# EAGLE design Suberu4 (EAGLE 5.11)

## Sheet 1 of 3
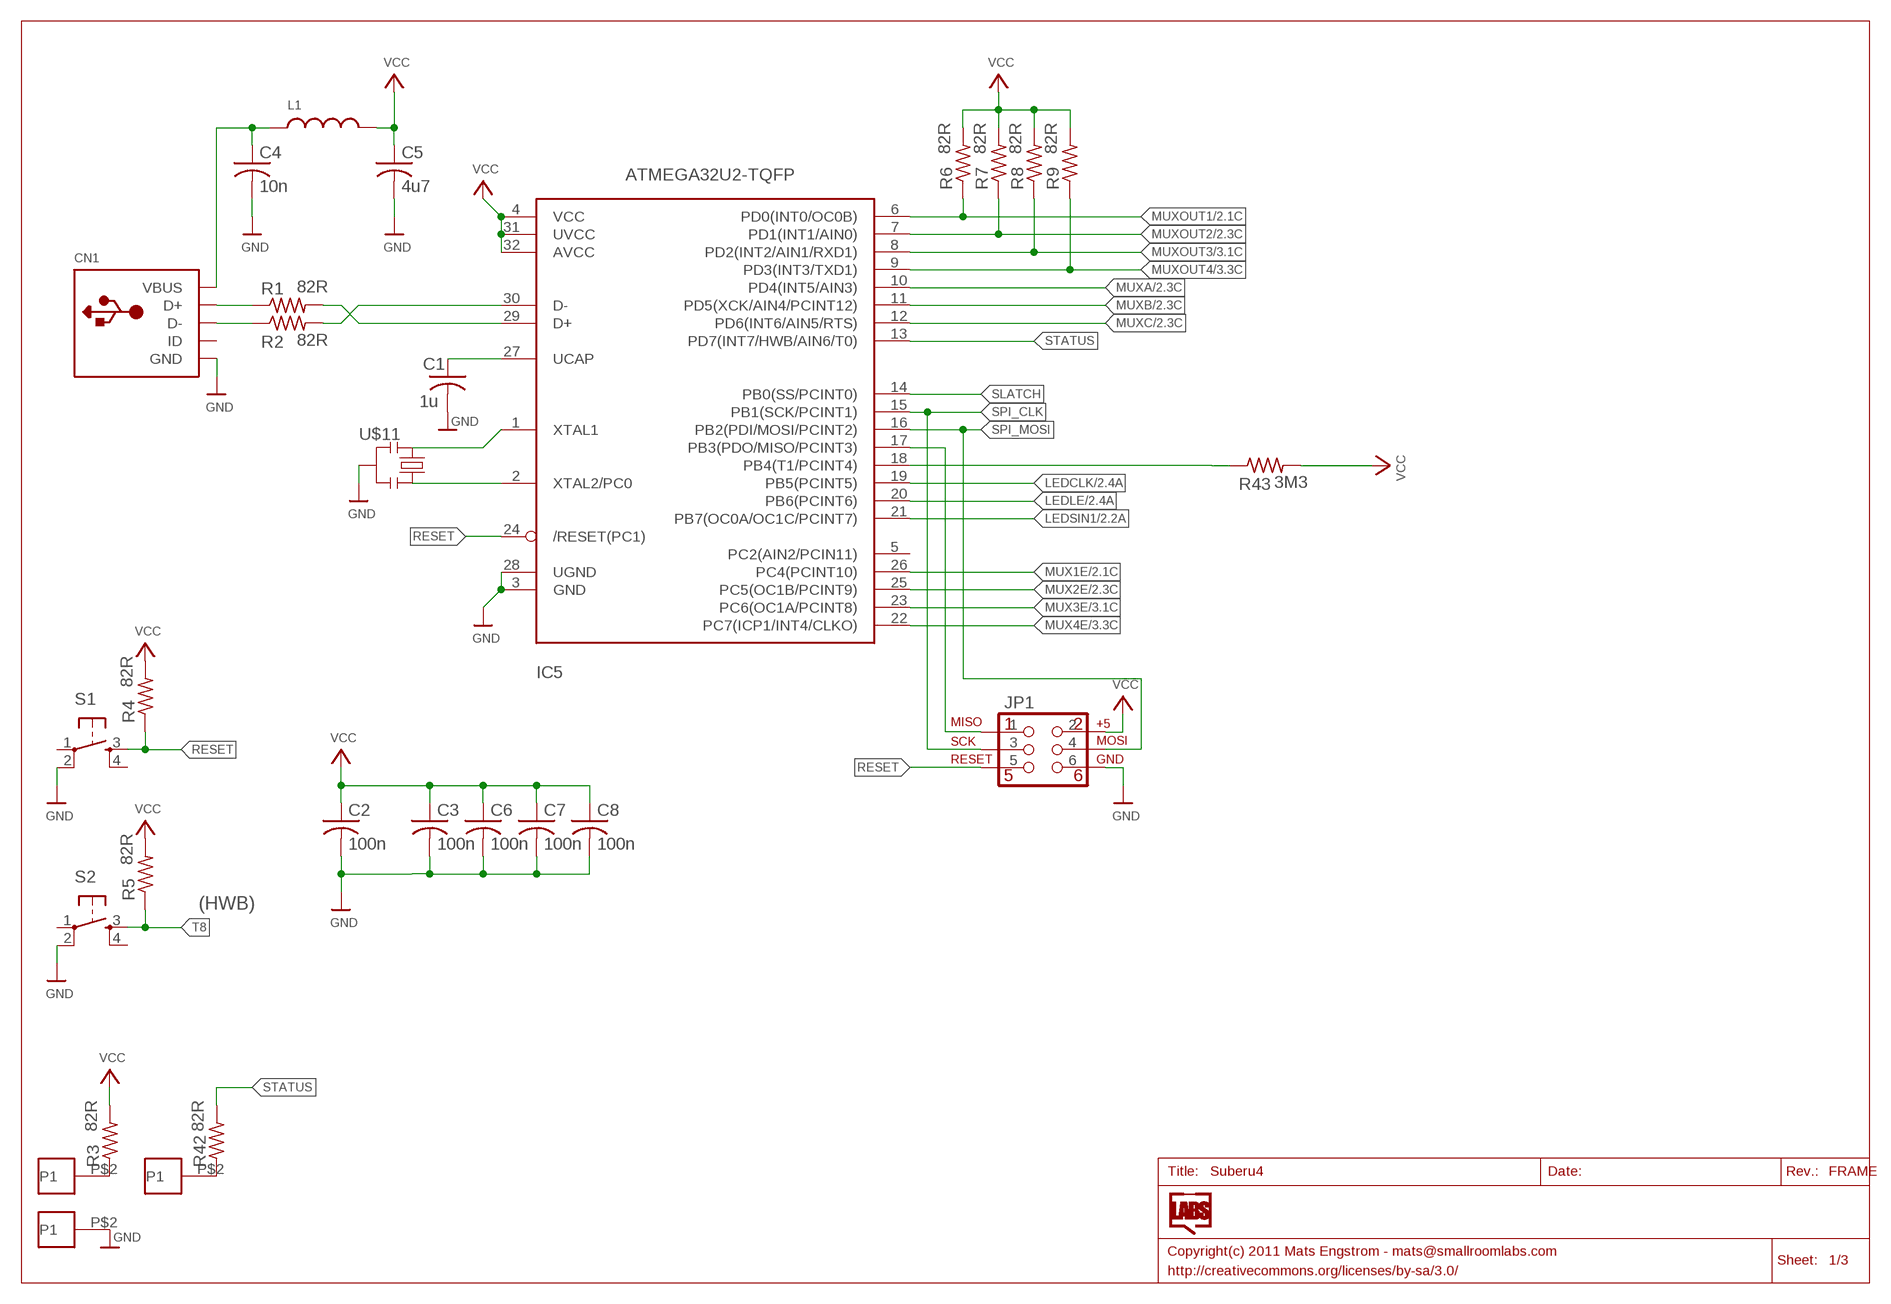
[diagram p0: schematic, sheet 1]

### Parts
C1  1u  C-USC0805  [C0805]
C2  100n  C-USC0805  [C0805]
C3  100n  C-USC0805  [C0805]
C4  10n  C-USC0805  [C0805]
C5  4u7  C-USC0805  [C0805]
C6  100n  C-USC0805  [C0805]
C7  100n  C-USC0805  [C0805]
C8  100n  C-USC0805  [C0805]
CN1  USBMINIB  [USB-MINIB]
IC5  ATMEGA32U2-TQFP  [TQFP32-08]
JP1  AVR-ISP6_TOUCH  [ISP-TOUCH]
L1  INDUCTOR0805  [0805]
R1  82R  R-US_R0805W  [R0805W]
R2  82R  R-US_R0805W  [R0805W]
R3  82R  R-US_R0805W  [R0805W]
R4  82R  R-US_R0805W  [R0805W]
R5  82R  R-US_R0805W  [R0805W]
R6  82R  R-US_R0805W  [R0805W]
R7  82R  R-US_R0805W  [R0805W]
R8  82R  R-US_R0805W  [R0805W]
R9  82R  R-US_R0805W  [R0805W]
R42  82R  R-US_R0805W  [R0805W]
R43  3M3  R-US_R0805W  [R0805W]
S1  TAC_SWITCHSMD  [TACTILE_SWITCH_SMD]
S2  TAC_SWITCHSMD  [TACTILE_SWITCH_SMD]
U$11  RESONATOR-WIDE  [RESONATOR-WIDE-SMD]
U$29  PAD-2X3  [PAD2X3]
U$30  PAD-2X3  [PAD2X3]
U$32  PAD-2X3  [PAD2X3]

### Nets
GND: C1.2 C2.2 C3.2 C4.2 C5.2 C6.2 C7.2 C8.2 CN1.GND IC5.3(GND) IC5.28(UGND) JP1.6(GND) S1.2 S2.2 U$11.2 U$30.P$2(P1) ; also sheet 2,3
LEDCLK: IC5.19(PB5(PCINT5)) ; also sheet 2,3
LEDLE: IC5.20(PB6(PCINT6)) ; also sheet 2,3
LEDSIN1: IC5.21(PB7(OC0A/OC1C/PCINT7)) ; also sheet 2
MUX1E: IC5.26(PC4(PCINT10)) ; also sheet 2
MUX2E: IC5.25(PC5(OC1B/PCINT9)) ; also sheet 2
MUX3E: IC5.23(PC6(OC1A/PCINT8)) ; also sheet 3
MUX4E: IC5.22(PC7(ICP1/INT4/CLKO)) ; also sheet 3
MUXA: IC5.10(PD4(INT5/AIN3)) ; also sheet 2,3
MUXB: IC5.11(PD5(XCK/AIN4/PCINT12)) ; also sheet 2,3
MUXC: IC5.12(PD6(INT6/AIN5/RTS)) ; also sheet 2,3
MUXOUT1: IC5.6(PD0(INT0/OC0B)) R6.1 ; also sheet 2
MUXOUT2: IC5.7(PD1(INT1/AIN0)) R7.1 ; also sheet 2
MUXOUT3: IC5.8(PD2(INT2/AIN1/RXD1)) R8.1 ; also sheet 3
MUXOUT4: IC5.9(PD3(INT3/TXD1)) R9.1 ; also sheet 3
N$3: CN1.D+ R1.1
N$4: CN1.D- R2.1
N$8: R3.1 U$29.P$2(P1)
N$9: R42.1 U$32.P$2(P1)
PB3: IC5.17(PB3(PDO/MISO/PCINT3)) JP1.1(MISO)
RESET: IC5.24(/RESET(PC1)) JP1.5(RESET) R4.1 S1.3
SETTING1: IC5.18(PB4(T1/PCINT4)) R43.1
SLATCH: IC5.14(PB0(SS/PCINT0))
SPI_CLK: IC5.15(PB1(SCK/PCINT1)) JP1.3(SCK)
SPI_MOSI: IC5.16(PB2(PDI/MOSI/PCINT2)) JP1.4(MOSI)
STATUS: IC5.13(PD7(INT7/HWB/AIN6/T0)) R42.2
T8: R5.1 S2.3
UCAP: C1.1 IC5.27(UCAP)
USBD+: IC5.29(D+) R1.2
USBD-: IC5.30(D-) R2.2
VBUS: C4.1 CN1.VBUS L1.1
VCC: C2.1 C3.1 C5.1 C6.1 C7.1 C8.1 IC5.4(VCC) IC5.31(UVCC) IC5.32(AVCC) JP1.2(V+) L1.2 R3.2 R4.2 R5.2 R6.2 R7.2 R8.2 R9.2 R43.2 ; also sheet 2,3
XTAL1: IC5.1(XTAL1) U$11.1
XTAL2: IC5.2(XTAL2/PC0) U$11.3
Unconnected: CN1.ID IC5.5(PC2(AIN2/PCIN11)) S1.1 S1.4 S2.1 S2.4

### Notes on the sheet
- (HWB)

## Sheet 2 of 3
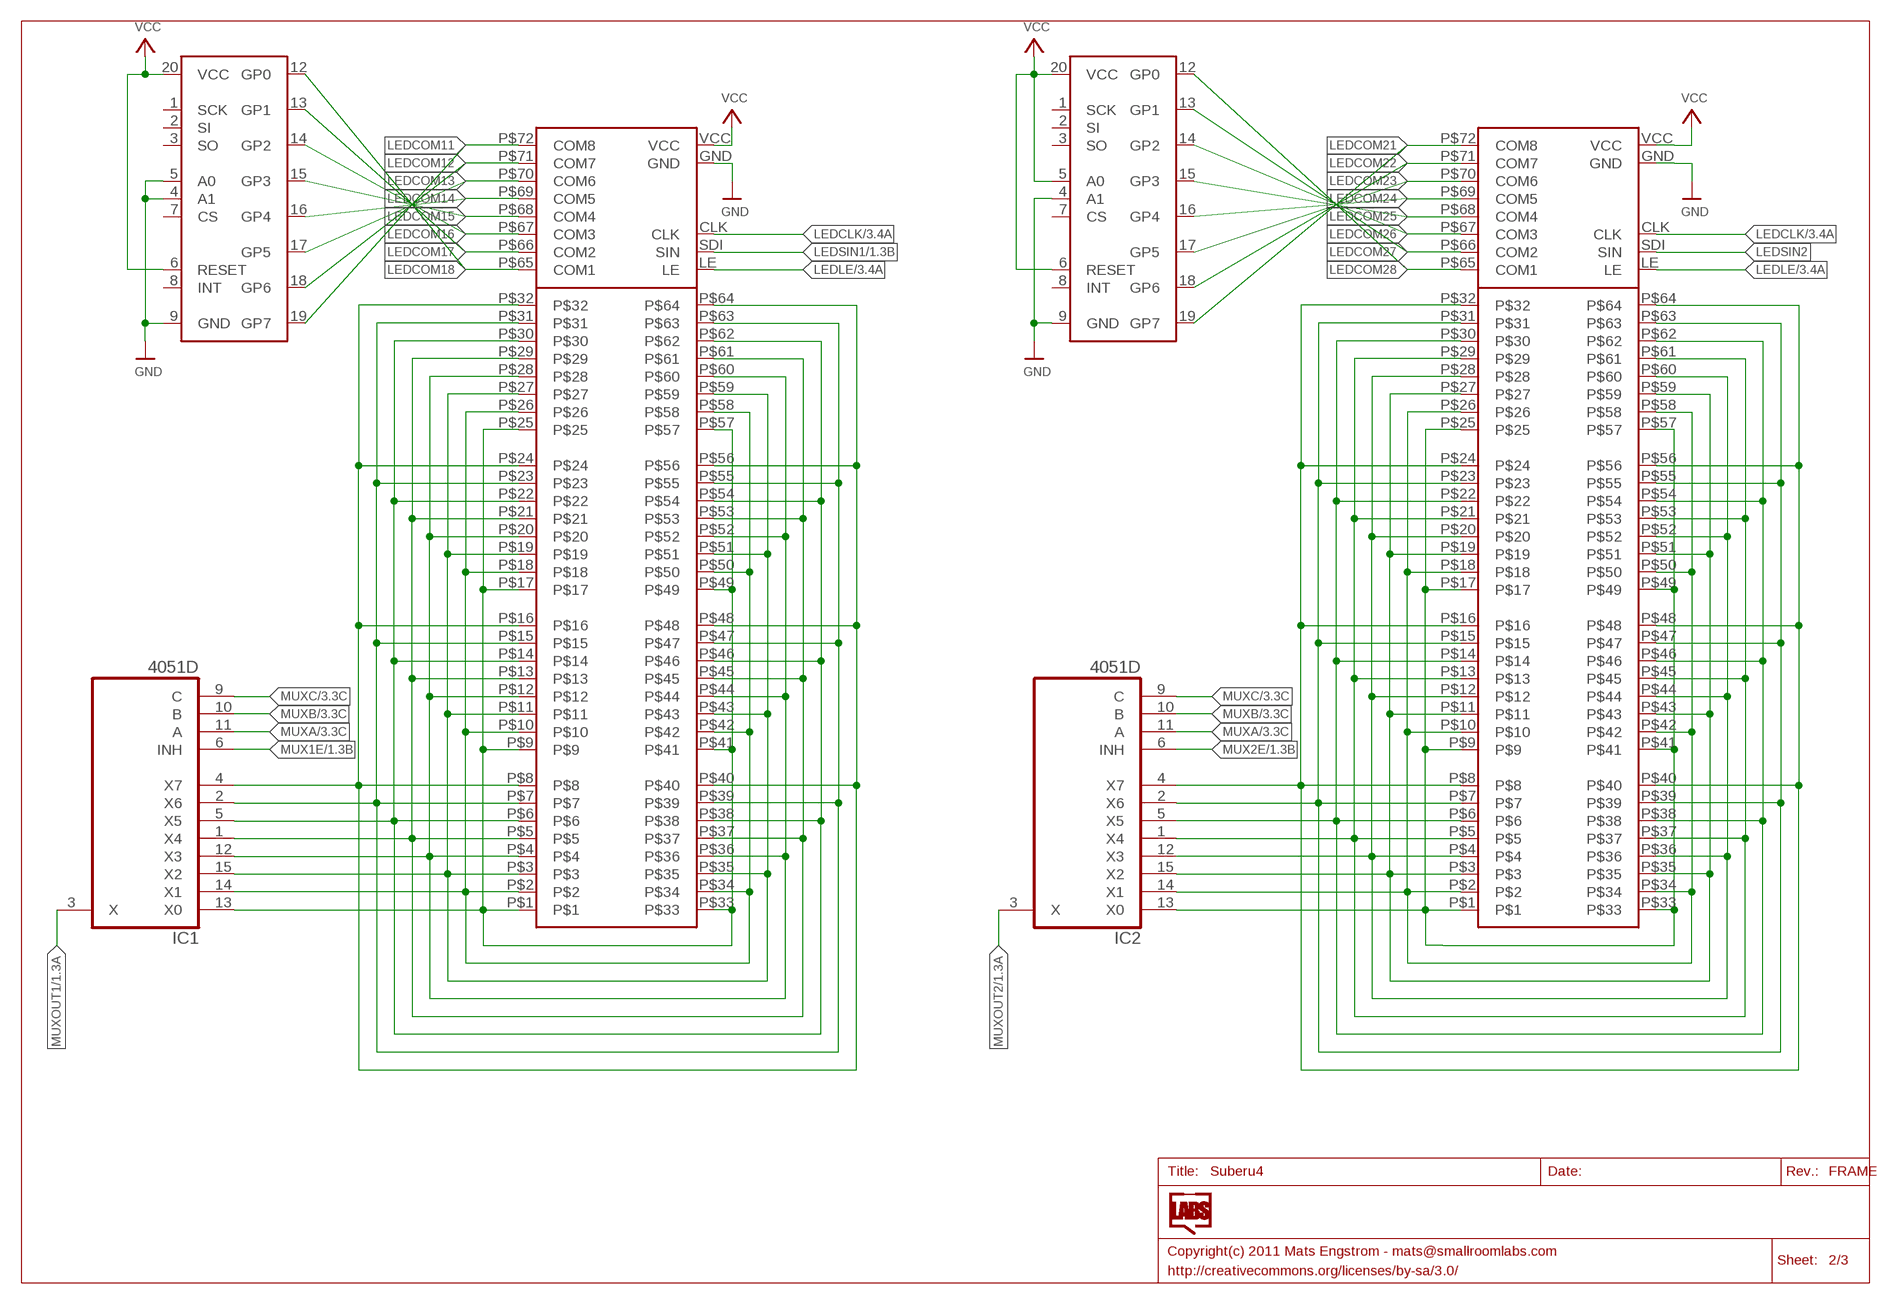
[diagram p1: schematic, sheet 2]

### Parts
IC1  4051D  [SO16]
IC2  4051D  [SO16]
IC6  MCP23S08  MCP23S08-SS  [SSOP20]
IC7  MCP23S08  MCP23S08-SS  [SSOP20]
U$1  SLIDER2  [SLIDER2]
U$2  SLIDER2  [SLIDER2]

### Nets
GND: IC6.4(A1) IC6.5(A0) IC6.9(GND) IC7.4(A1) IC7.9(GND) U$1.GND U$2.GND ; also sheet 1,3
LEDCLK: U$1.CLK U$2.CLK ; also sheet 1,3
LEDCOM11: IC6.19(GP7) U$1.P$72(COM8)
LEDCOM12: IC6.18(GP6) U$1.P$71(COM7)
LEDCOM13: IC6.17(GP5) U$1.P$70(COM6)
LEDCOM14: IC6.16(GP4) U$1.P$69(COM5)
LEDCOM15: IC6.15(GP3) U$1.P$68(COM4)
LEDCOM16: IC6.14(GP2) U$1.P$67(COM3)
LEDCOM17: IC6.13(GP1) U$1.P$66(COM2)
LEDCOM18: IC6.12(GP0) U$1.P$65(COM1)
LEDCOM21: IC7.19(GP7) U$2.P$72(COM8)
LEDCOM22: IC7.18(GP6) U$2.P$71(COM7)
LEDCOM23: IC7.17(GP5) U$2.P$70(COM6)
LEDCOM24: IC7.16(GP4) U$2.P$69(COM5)
LEDCOM25: IC7.15(GP3) U$2.P$68(COM4)
LEDCOM26: IC7.14(GP2) U$2.P$67(COM3)
LEDCOM27: IC7.13(GP1) U$2.P$66(COM2)
LEDCOM28: IC7.12(GP0) U$2.P$65(COM1)
LEDLE: U$1.LE U$2.LE ; also sheet 1,3
LEDSIN1: U$1.SDI(SIN) ; also sheet 1
LEDSIN2: U$2.SDI(SIN)
MUX1E: IC1.6(INH) ; also sheet 1
MUX2E: IC2.6(INH) ; also sheet 1
MUXA: IC1.11(A) IC2.11(A) ; also sheet 1,3
MUXB: IC1.10(B) IC2.10(B) ; also sheet 1,3
MUXC: IC1.9(C) IC2.9(C) ; also sheet 1,3
MUXOUT1: IC1.3(X) ; also sheet 1
MUXOUT2: IC2.3(X) ; also sheet 1
TB1 [sensor]: IC1.13(X0) U$1.P$1 U$1.P$9 U$1.P$17 U$1.P$25 U$1.P$33 U$1.P$41 U$1.P$49 U$1.P$57
TB2 [sensor]: IC2.13(X0) U$2.P$1 U$2.P$9 U$2.P$17 U$2.P$25 U$2.P$33 U$2.P$41 U$2.P$49 U$2.P$57
TB12 [sensor]: IC1.14(X1) U$1.P$2 U$1.P$10 U$1.P$18 U$1.P$26 U$1.P$34 U$1.P$42 U$1.P$50 U$1.P$58
TB13 [sensor]: IC1.15(X2) U$1.P$3 U$1.P$11 U$1.P$19 U$1.P$27 U$1.P$35 U$1.P$43 U$1.P$51 U$1.P$59
TB14 [sensor]: IC1.12(X3) U$1.P$4 U$1.P$12 U$1.P$20 U$1.P$28 U$1.P$36 U$1.P$44 U$1.P$52 U$1.P$60
TB15 [sensor]: IC1.1(X4) U$1.P$5 U$1.P$13 U$1.P$21 U$1.P$29 U$1.P$37 U$1.P$45 U$1.P$53 U$1.P$61
TB16 [sensor]: IC1.5(X5) U$1.P$6 U$1.P$14 U$1.P$22 U$1.P$30 U$1.P$38 U$1.P$46 U$1.P$54 U$1.P$62
TB17 [sensor]: IC1.2(X6) U$1.P$7 U$1.P$15 U$1.P$23 U$1.P$31 U$1.P$39 U$1.P$47 U$1.P$55 U$1.P$63
TB18 [sensor]: IC1.4(X7) U$1.P$8 U$1.P$16 U$1.P$24 U$1.P$32 U$1.P$40 U$1.P$48 U$1.P$56 U$1.P$64
TB33 [sensor]: IC2.14(X1) U$2.P$2 U$2.P$10 U$2.P$18 U$2.P$26 U$2.P$34 U$2.P$42 U$2.P$50 U$2.P$58
TB34 [sensor]: IC2.15(X2) U$2.P$3 U$2.P$11 U$2.P$19 U$2.P$27 U$2.P$35 U$2.P$43 U$2.P$51 U$2.P$59
TB35 [sensor]: IC2.12(X3) U$2.P$4 U$2.P$12 U$2.P$20 U$2.P$28 U$2.P$36 U$2.P$44 U$2.P$52 U$2.P$60
TB36 [sensor]: IC2.1(X4) U$2.P$5 U$2.P$13 U$2.P$21 U$2.P$29 U$2.P$37 U$2.P$45 U$2.P$53 U$2.P$61
TB37 [sensor]: IC2.5(X5) U$2.P$6 U$2.P$14 U$2.P$22 U$2.P$30 U$2.P$38 U$2.P$46 U$2.P$54 U$2.P$62
TB38 [sensor]: IC2.2(X6) U$2.P$7 U$2.P$15 U$2.P$23 U$2.P$31 U$2.P$39 U$2.P$47 U$2.P$55 U$2.P$63
TB39 [sensor]: IC2.4(X7) U$2.P$8 U$2.P$16 U$2.P$24 U$2.P$32 U$2.P$40 U$2.P$48 U$2.P$56 U$2.P$64
VCC: IC6.6(RESET) IC6.20(VCC) IC7.5(A0) IC7.6(RESET) IC7.20(VCC) U$1.VCC U$2.VCC ; also sheet 1,3
Unconnected: IC6.1(SCK) IC6.2(SI) IC6.3(SO) IC6.7(CS) IC6.8(INT) IC7.1(SCK) IC7.2(SI) IC7.3(SO) IC7.7(CS) IC7.8(INT)

## Sheet 3 of 3
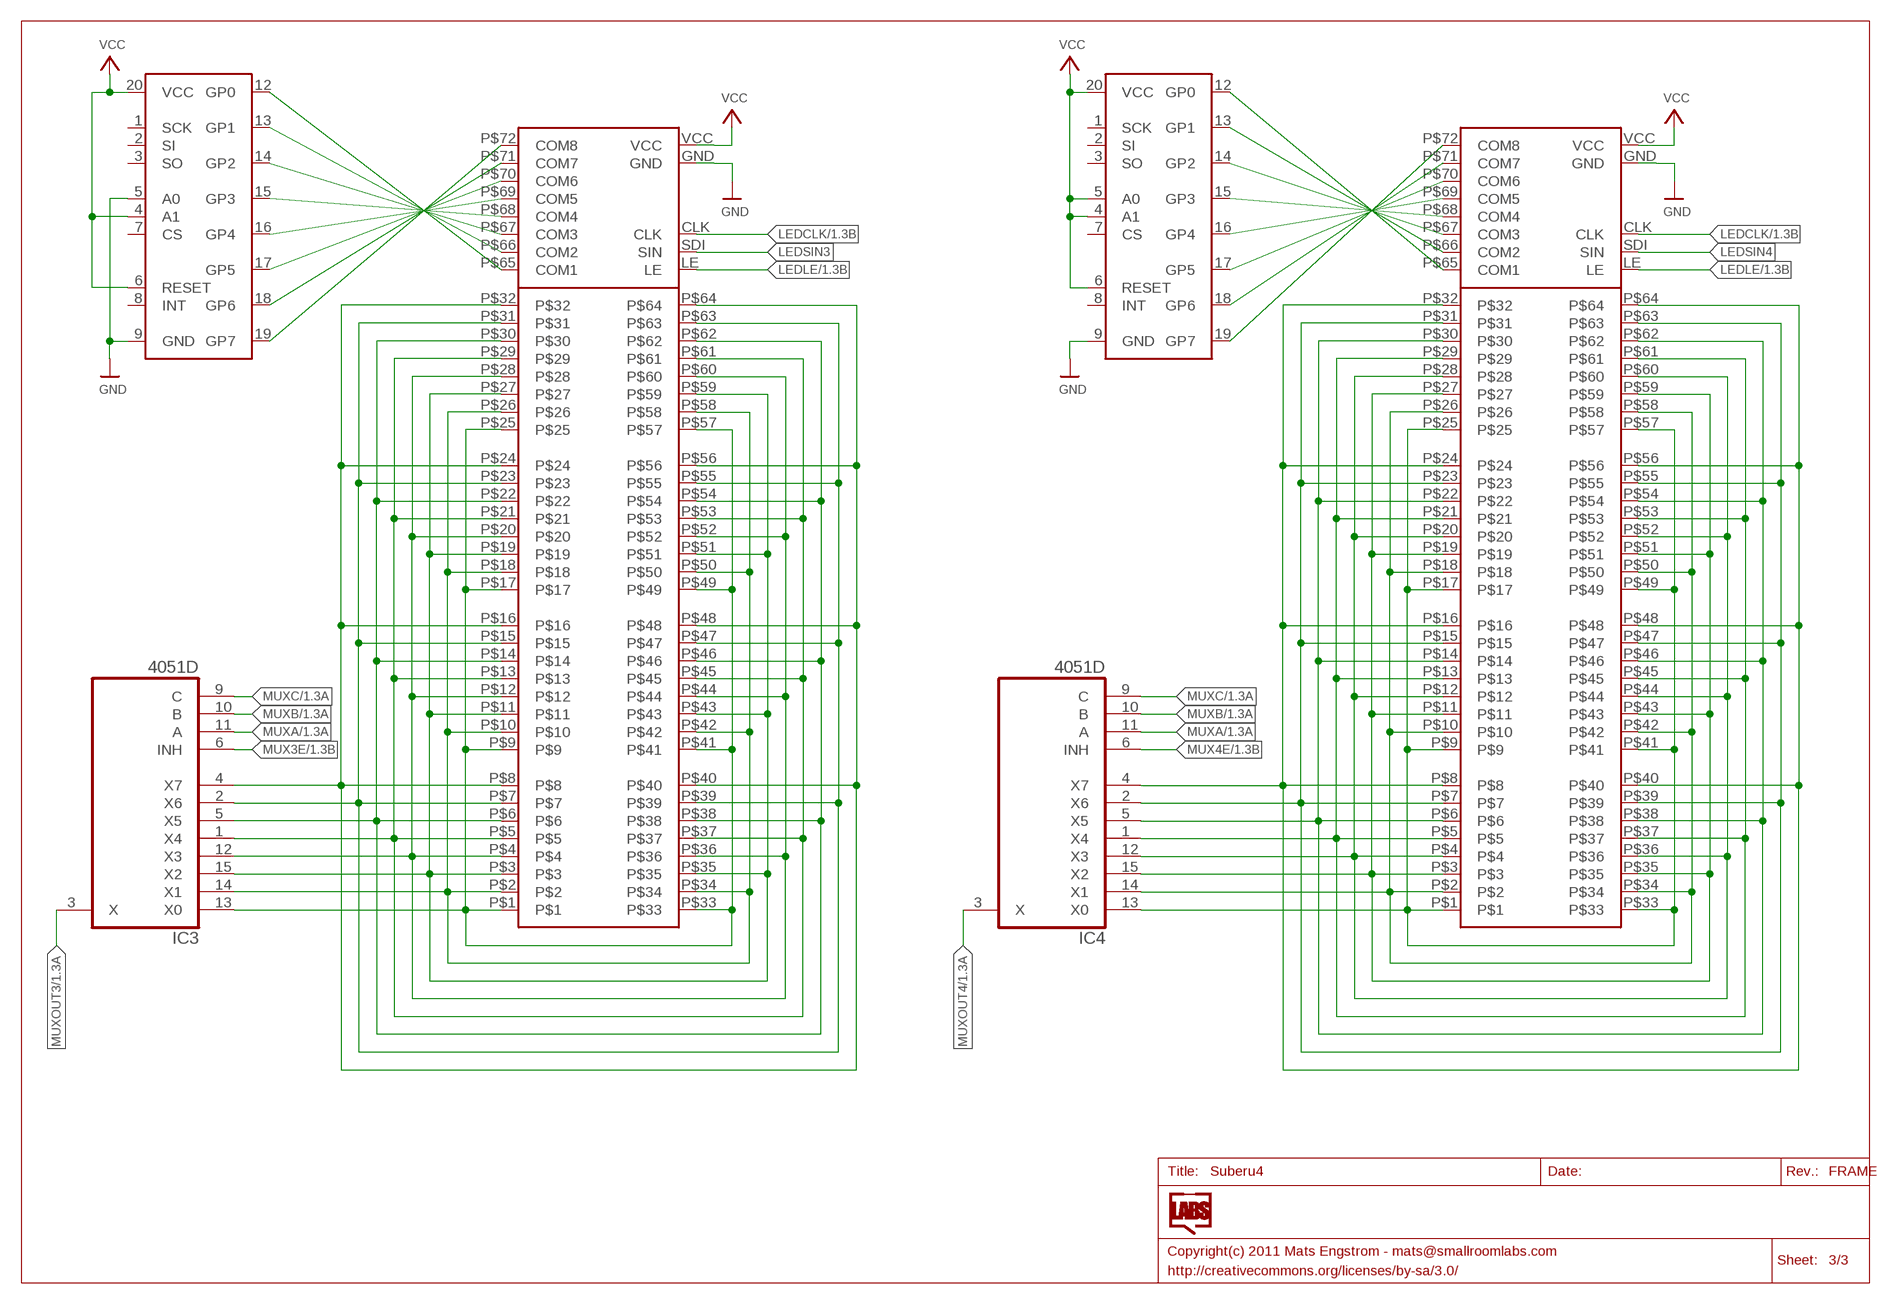
[diagram p2: schematic, sheet 3]

### Parts
IC3  4051D  [SO16]
IC4  4051D  [SO16]
IC8  MCP23S08-SS  [SSOP20]
IC9  MCP23S08-SS  [SSOP20]
U$3  SLIDER2  [SLIDER2]
U$4  SLIDER2  [SLIDER2]

### Nets
GND: IC8.5(A0) IC8.9(GND) IC9.9(GND) U$3.GND U$4.GND ; also sheet 1,2
LEDCLK: U$3.CLK U$4.CLK ; also sheet 1,2
LEDLE: U$3.LE U$4.LE ; also sheet 1,2
LEDSIN3: U$3.SDI(SIN)
LEDSIN4: U$4.SDI(SIN)
MUX3E: IC3.6(INH) ; also sheet 1
MUX4E: IC4.6(INH) ; also sheet 1
MUXA: IC3.11(A) IC4.11(A) ; also sheet 1,2
MUXB: IC3.10(B) IC4.10(B) ; also sheet 1,2
MUXC: IC3.9(C) IC4.9(C) ; also sheet 1,2
MUXOUT3: IC3.3(X) ; also sheet 1
MUXOUT4: IC4.3(X) ; also sheet 1
N$1: IC9.19(GP7) U$4.P$72(COM8)
N$2: IC9.18(GP6) U$4.P$71(COM7)
N$6: IC9.17(GP5) U$4.P$70(COM6)
N$7: IC9.16(GP4) U$4.P$69(COM5)
N$11: IC9.15(GP3) U$4.P$68(COM4)
N$12: IC9.14(GP2) U$4.P$67(COM3)
N$13: IC9.13(GP1) U$4.P$66(COM2)
N$14: IC9.12(GP0) U$4.P$65(COM1)
N$15: IC8.12(GP0) U$3.P$65(COM1)
N$16: IC8.13(GP1) U$3.P$66(COM2)
N$17: IC8.14(GP2) U$3.P$67(COM3)
N$18: IC8.15(GP3) U$3.P$68(COM4)
N$19: IC8.16(GP4) U$3.P$69(COM5)
N$20: IC8.17(GP5) U$3.P$70(COM6)
N$21: IC8.18(GP6) U$3.P$71(COM7)
N$22: IC8.19(GP7) U$3.P$72(COM8)
TB10 [sensor]: IC3.13(X0) U$3.P$1 U$3.P$9 U$3.P$17 U$3.P$25 U$3.P$33 U$3.P$41 U$3.P$49 U$3.P$57
TB11 [sensor]: IC3.14(X1) U$3.P$2 U$3.P$10 U$3.P$18 U$3.P$26 U$3.P$34 U$3.P$42 U$3.P$50 U$3.P$58
TB19 [sensor]: IC3.15(X2) U$3.P$3 U$3.P$11 U$3.P$19 U$3.P$27 U$3.P$35 U$3.P$43 U$3.P$51 U$3.P$59
TB20 [sensor]: IC3.12(X3) U$3.P$4 U$3.P$12 U$3.P$20 U$3.P$28 U$3.P$36 U$3.P$44 U$3.P$52 U$3.P$60
TB21 [sensor]: IC3.1(X4) U$3.P$5 U$3.P$13 U$3.P$21 U$3.P$29 U$3.P$37 U$3.P$45 U$3.P$53 U$3.P$61
TB22 [sensor]: IC3.5(X5) U$3.P$6 U$3.P$14 U$3.P$22 U$3.P$30 U$3.P$38 U$3.P$46 U$3.P$54 U$3.P$62
TB23 [sensor]: IC3.2(X6) U$3.P$7 U$3.P$15 U$3.P$23 U$3.P$31 U$3.P$39 U$3.P$47 U$3.P$55 U$3.P$63
TB24 [sensor]: IC3.4(X7) U$3.P$8 U$3.P$16 U$3.P$24 U$3.P$32 U$3.P$40 U$3.P$48 U$3.P$56 U$3.P$64
TB25 [sensor]: IC4.13(X0) U$4.P$1 U$4.P$9 U$4.P$17 U$4.P$25 U$4.P$33 U$4.P$41 U$4.P$49 U$4.P$57
TB26 [sensor]: IC4.14(X1) U$4.P$2 U$4.P$10 U$4.P$18 U$4.P$26 U$4.P$34 U$4.P$42 U$4.P$50 U$4.P$58
TB27 [sensor]: IC4.15(X2) U$4.P$3 U$4.P$11 U$4.P$19 U$4.P$27 U$4.P$35 U$4.P$43 U$4.P$51 U$4.P$59
TB28 [sensor]: IC4.12(X3) U$4.P$4 U$4.P$12 U$4.P$20 U$4.P$28 U$4.P$36 U$4.P$44 U$4.P$52 U$4.P$60
TB29 [sensor]: IC4.1(X4) U$4.P$5 U$4.P$13 U$4.P$21 U$4.P$29 U$4.P$37 U$4.P$45 U$4.P$53 U$4.P$61
TB30 [sensor]: IC4.5(X5) U$4.P$6 U$4.P$14 U$4.P$22 U$4.P$30 U$4.P$38 U$4.P$46 U$4.P$54 U$4.P$62
TB31 [sensor]: IC4.2(X6) U$4.P$7 U$4.P$15 U$4.P$23 U$4.P$31 U$4.P$39 U$4.P$47 U$4.P$55 U$4.P$63
TB32 [sensor]: IC4.4(X7) U$4.P$8 U$4.P$16 U$4.P$24 U$4.P$32 U$4.P$40 U$4.P$48 U$4.P$56 U$4.P$64
VCC: IC8.4(A1) IC8.6(RESET) IC8.20(VCC) IC9.4(A1) IC9.5(A0) IC9.6(RESET) IC9.20(VCC) U$3.VCC U$4.VCC ; also sheet 1,2
Unconnected: IC8.1(SCK) IC8.2(SI) IC8.3(SO) IC8.7(CS) IC8.8(INT) IC9.1(SCK) IC9.2(SI) IC9.3(SO) IC9.7(CS) IC9.8(INT)

## Power pins joined to a net without a drawn wire
GND: IC1.8(GND) IC2.8(GND) IC3.8(GND) IC4.8(GND)
VCC: IC1.16(VCC) IC2.16(VCC) IC3.16(VCC) IC4.16(VCC)
VEE: IC1.7(VEE) IC2.7(VEE) IC3.7(VEE) IC4.7(VEE)

## Library data of the parts
C1-C8 = adafruit:C-US: CAPACITOR, American symbol
CN1 = adafruit:USB: USB Connectors USBMINIB - Surface Mount Female Mini-B USB Connector 4UConnector: 06564 By microbuilder.eu Thru-hole RA Female Mini-B USB Connector 4UConnector: 18732 By ladyada.net
IC1-IC4 = 40xx:4051: 8-channel ANALOG MULTIPLEXER
IC5 = adafruit:ATMEGA32U2: ATmega32u2 Pin compatible with the atmega8u2, atmega16u2 and atmega32u2 8, 16 or 32 K flash, 1K RAM, 512b EEPROM 8 bit and 16 bit timer (5 PWM total) UART, SPI (no I2C!) USB with 4 endpoints, LUFA compatible 22 I/O lines, analog comparator (no ADC!) Comes with DFU bootloader burned in!
IC6-IC9 = SmallRoomLabs:MCP23S08
JP1 = SmallRoomLabs:AVR-ISP6
L1 = microbuilder:INDUCTOR: Inductors 0603: 10nH Ceramic Inductor - microwire antenna/RF (Digikey: 712-1434-2-ND) 0805: 560nH Ceramic Inductor - RF (Digikey: 553-1047-1-ND) 1007 (2518 Metric) SMT: 10µH 10% 250mOhm 820mA 1007 Inductor (Digikey: 587-2189-1-ND) 22µH 10% 500mOhm 580mA 1007 Inductor (Digikey: 587-2190-1-ND) 47µH 10% 950mOhm 420mA 1007 Inductor (Digikey: 587-2191-1-ND) 47µH 5% 100mOhm 1A 1008 Inductor (Digikey: 732-1816-1-ND)
R1-R9 R42 R43 = adafruit:R-US_: RESISTOR, American symbol
S1 S2 = SparkFun:TAC_SWITCH: Momentary Switch Button commonly used for reset or general input. Spark Fun Electronics SKU : COM-00097
U$1-U$4 = SmallRoomLabs:SLIDER2
U$11 = SparkFun:RESONATOR-WIDE
U$29 U$30 U$32 = SmallRoomLabs:PAD

## Net classes
0 default: width 0.2 mm, clearance 0.2 mm
1 sensor: width 0.152 mm, clearance 0.152 mm

## Board
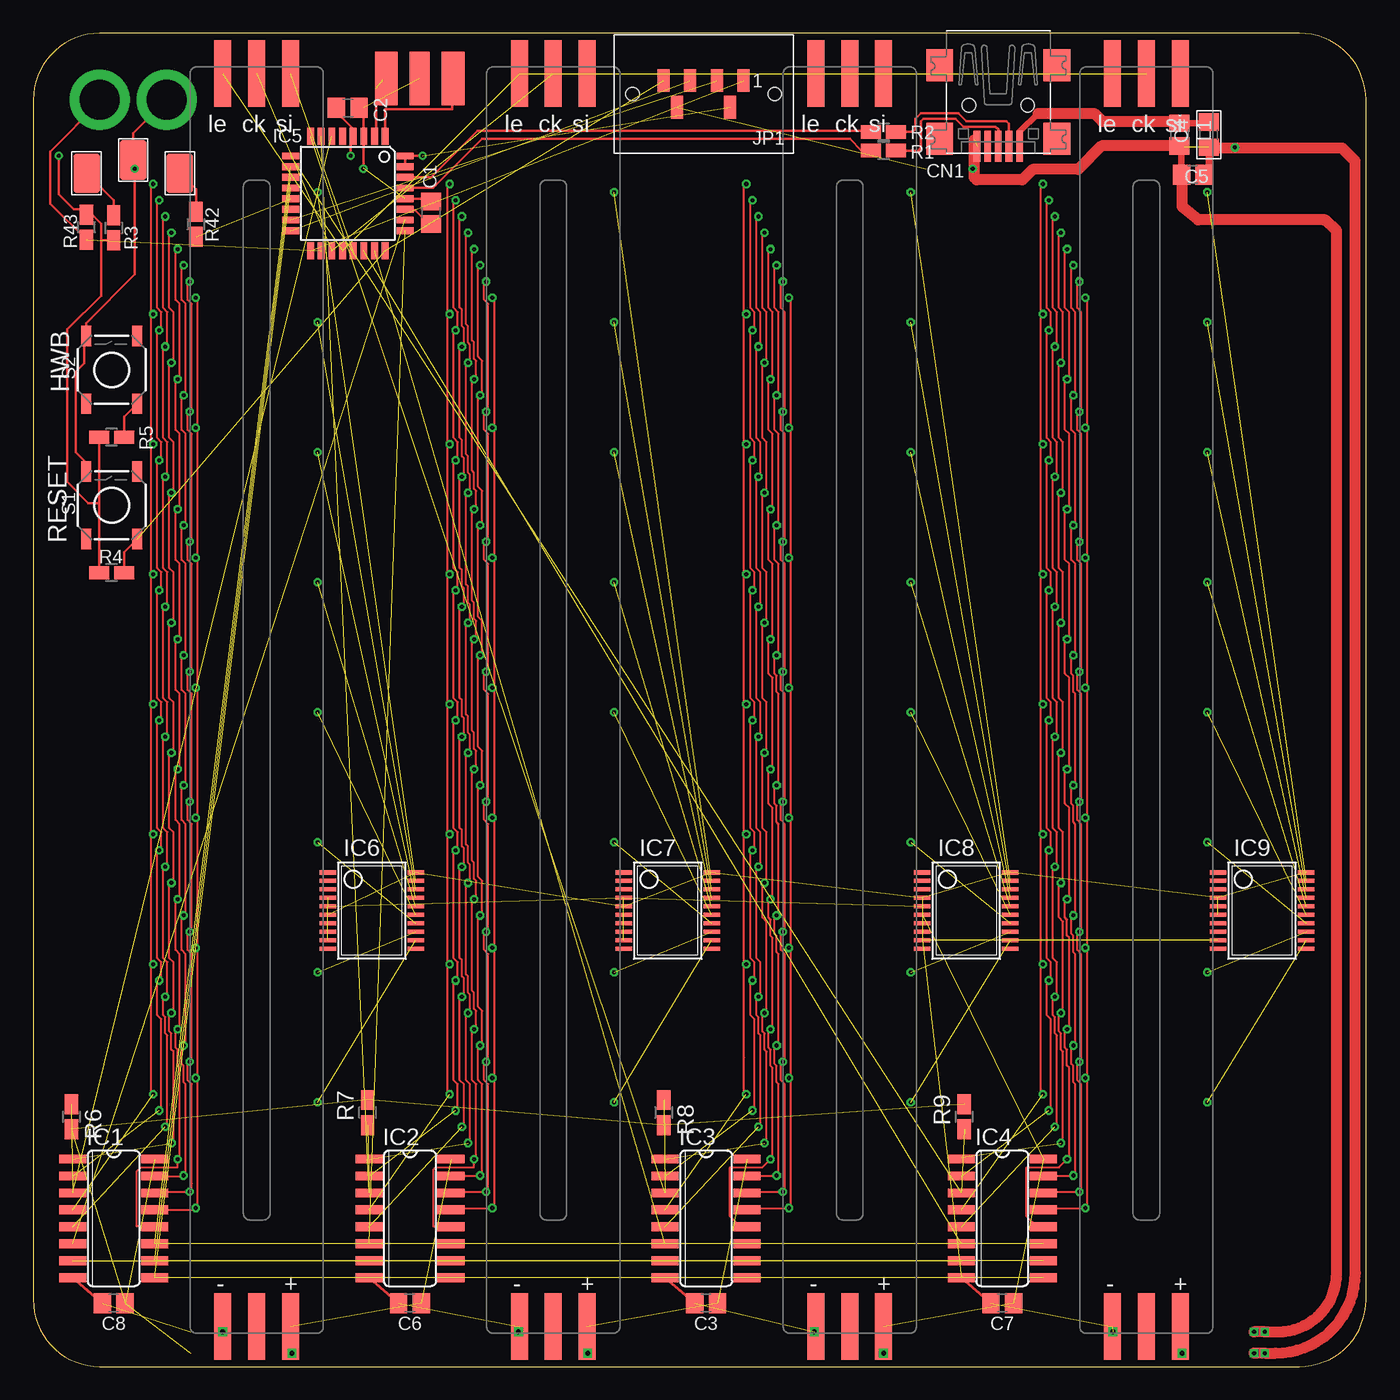
[diagram p3: board, top side]
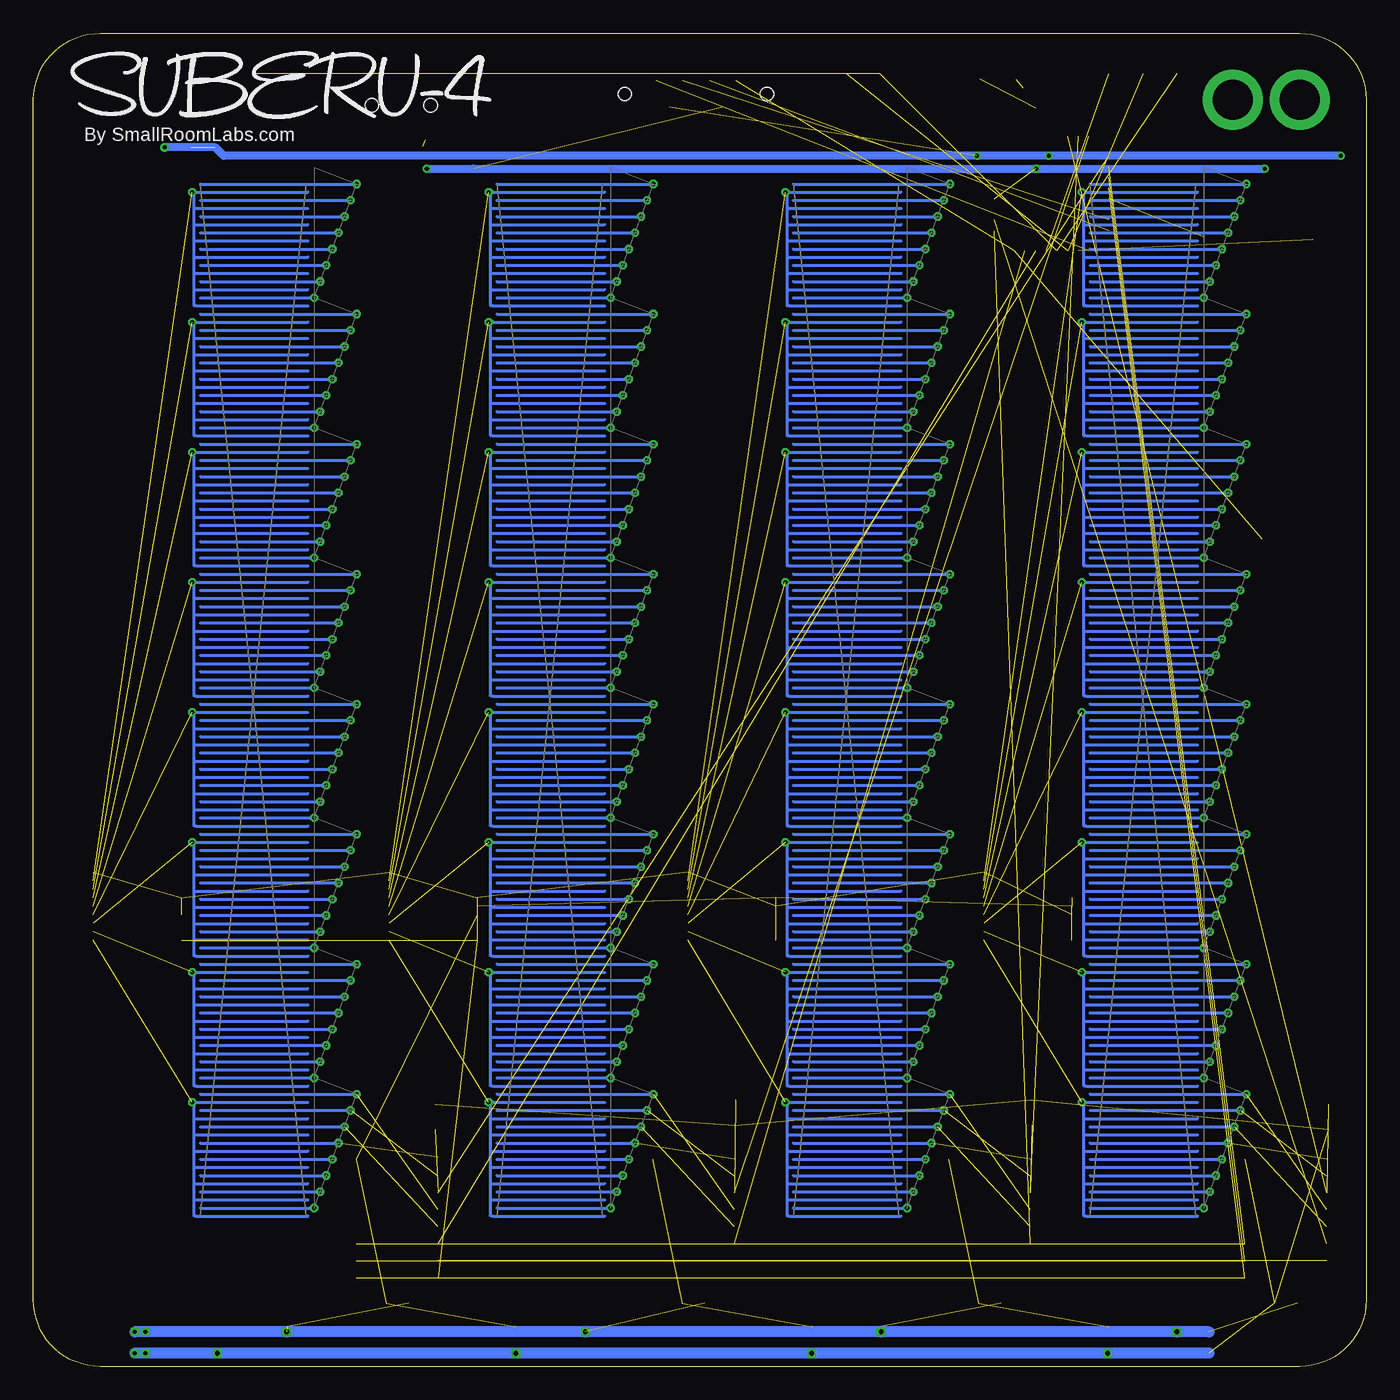
[diagram p4: board, bottom side, seen from below]

Size 100 x 100 mm. Coordinates in mm from the lower left corner, seen from the top.
Outline: 50,100 5,100 arc90 0,95 0,50 0,5 arc90 5,0 50,0 95,0 arc90 100,5 100,50 100,95 arc90 95,100 50,100
Copper layers (1*16): Top 0.035mm / dielectric 1.5mm / Bottom 0.035mm
Design rules "Fusion_eagle_rule_v1.1 *": minimum track width 6mil, minimum drill 12mil, track to track 6mil, track to pad 6mil, pad to pad 6mil, via to via 6mil, smd to smd 0mil, copper to edge 10mil, drill to drill 10mil, minimum pad ring 6mil, minimum via ring 6mil, stop-mask expansion 2mil, vias tented up to drill 100mil, thermal gap 10mil

### Footprints (pad centres in the part's own frame; a part is rotated, then mirrored left to right if it is on the bottom)
C0805 = smd 1.3 x 1.5: 1 -0.85,0; 2 0.85,0
USB-MINIB = smd 0.5 x 2.308: D+ 0,4.064; D- -0.8,4.064; GND 1.6,4.064; ID 0.8,4.064; VBUS -1.6,4.064 | smd 2 x 2.4: GND1 -4.4,-2; GND2 -4.4,3.5; GND3 4.4,3.5; GND4 4.4,-2 | hole 1: -2.2,1; 2.2,1
SO16 = smd 0.66 x 2.032: 1 -4.445,-3.073; 2 -3.175,-3.073; 3 -1.905,-3.073; 4 -0.635,-3.073; 5 0.635,-3.073; 6 1.905,-3.073; 7 3.175,-3.073; 8 4.445,-3.073; 9 4.445,3.073; 10 3.175,3.073; 11 1.905,3.073; 12 0.635,3.073; 13 -0.635,3.073; 14 -1.905,3.073; 15 -3.175,3.073; 16 -4.445,3.073
TQFP32-08 = smd 1.27 x 0.508: 1 -4.293,2.8; 2 -4.293,2; 3 -4.293,1.2; 4 -4.293,0.4; 5 -4.293,-0.4; 6 -4.293,-1.2; 7 -4.293,-2; 8 -4.293,-2.8; 17 4.293,-2.8; 18 4.293,-2; 19 4.293,-1.2; 20 4.293,-0.4; 21 4.293,0.4; 22 4.293,1.2; 23 4.293,2; 24 4.293,2.8 | smd 0.508 x 1.27: 9 -2.8,-4.293; 10 -2,-4.293; 11 -1.2,-4.293; 12 -0.4,-4.293; 13 0.4,-4.293; 14 1.2,-4.293; 15 2,-4.293; 16 2.8,-4.293; 25 2.8,4.293; 26 2,4.293; 27 1.2,4.293; 28 0.4,4.293; 29 -0.4,4.293; 30 -1.2,4.293; 31 -2,4.293; 32 -2.8,4.293
SSOP20 = smd 0.305 x 1.245: 1 -2.857,-3.302; 2 -2.222,-3.302; 3 -1.587,-3.302; 4 -0.952,-3.302; 5 -0.317,-3.302; 6 0.318,-3.302; 7 0.953,-3.302; 8 1.588,-3.302; 9 2.223,-3.302; 10 2.858,-3.302; 11 2.858,3.302; 12 2.223,3.302; 13 1.588,3.302; 14 0.953,3.302; 15 0.318,3.302; 16 -0.317,3.302; 17 -0.952,3.302; 18 -1.587,3.302; 19 -2.222,3.302; 20 -2.857,3.302
ISP-TOUCH = smd 0.9 x 1.7: 1 -3,-1; 2 -2,1; 3 -1,-1; 4 1,-1; 5 3,-1; 6 2,1 | hole 1: -5.334,0; 5.334,0
0805 = smd 1.3 x 1.5: 1 -0.95,0; 2 0.95,0
R0805W = smd 1.5 x 1: 1 -0.94,0; 2 0.94,0
TACTILE_SWITCH_SMD = smd 1.524 x 0.762: 1 -2.54,1.905; 2 2.54,1.905; 3 -2.54,-1.905; 4 2.54,-1.905
SLIDER2 = smd 1.27 x 5 bottom: CLK 3.962,85.7; GND 6.502,-8.28; LE 6.502,85.7; P$73 3.962,-8.28; SDI 1.422,85.7; VCC 1.422,-8.28 | drill 0.305 pad 0.61 octagon: P$1 8.534,0.61; P$2 8.992,1.829; P$3 9.449,3.048; P$4 9.906,4.267; P$5 10.363,5.486; P$6 10.82,6.706; P$7 11.278,7.925; P$8 11.735,9.144; P$9 8.534,10.363; P$10 8.992,11.582; P$11 9.449,12.802; P$12 9.906,14.021; P$13 10.363,15.24; P$14 10.82,16.459; P$15 11.278,17.678; P$16 11.735,18.898; P$17 8.534,20.117; P$18 8.992,21.336; P$19 9.449,22.555; P$20 9.906,23.774; P$21 10.363,24.994; P$22 10.82,26.213; P$23 11.278,27.432; P$24 11.735,28.651; P$25 8.534,29.87; P$26 8.992,31.09; P$27 9.449,32.309; P$28 9.906,33.528; P$29 10.363,34.747; P$30 10.82,35.966; P$31 11.278,37.186; P$32 11.735,38.405; P$33 8.534,39.624; P$34 8.992,40.843; P$35 9.449,42.062; P$36 9.906,43.282; P$37 10.363,44.501; P$38 10.82,45.72; P$39 11.278,46.939; P$40 11.735,48.158; P$41 8.534,49.378; P$42 8.992,50.597; P$43 9.449,51.816; P$44 9.906,53.035; P$45 10.363,54.254; P$46 10.82,55.474; P$47 11.278,56.693; P$48 11.735,57.912; P$49 8.534,59.131; P$50 8.992,60.35; P$51 9.449,61.57; P$52 9.906,62.789; P$53 10.363,64.008; P$54 10.82,65.227; P$55 11.278,66.446; P$56 11.735,67.666; P$57 8.534,68.885; P$58 8.992,70.104; P$59 9.449,71.323; P$60 9.906,72.542; P$61 10.363,73.762; P$62 10.82,74.981; P$63 11.278,76.2; P$64 11.735,77.419; P$65 -0.61,8.534; P$66 -0.61,18.288; P$67 -0.61,28.042; P$68 -0.61,37.795; P$69 -0.61,47.549; P$70 -0.61,57.302; P$71 -0.61,67.056; P$72 -0.61,76.81
RESONATOR-WIDE-SMD = smd 1.7 x 4: 1 -2.5,0; 3 2.5,0 | smd 1.5 x 4: 2 0,0
PAD2X3 = smd 2 x 3: P$2 0,0

### Placement (x,y rotation side)
C1  29.84,86.54 90 top
C2  23.6,94.4 0 top
C3  50.48,4.76 180 top
C4  86,92.4 270 top
C5  87,89.4 180 top
C6  28.26,4.76 180 top
C7  72.71,4.76 180 top
C8  6.03,4.76 180 top
CN1  72.4,95.6 180 top
IC1  6.03,11.11 270 top
IC2  28.26,11.11 270 top
IC3  50.48,11.11 270 top
IC4  72.71,11.11 270 top
IC5  23.6,88 270 top
IC6  25.4,34.2 270 top
IC7  47.6,34.2 270 top
IC8  70,34.2 270 top
IC9  92.2,34.2 270 top
JP1  50.29,95.45 180 top
L1  88.2,92.4 270 top
R1  63.8,91.2 180 top
R2  63.8,92.6 180 top
R3  6.03,85.41 270 top
R4  5.87,59.54 180 top
R5  5.87,69.7 180 top
R6  2.86,18.73 270 top
R7  25.08,19.05 90 top
R8  47.31,19.05 270 top
R9  69.85,18.73 90 top
R42  12.2,85.68 270 top
R43  3.99,85.45 90 top
S1  5.88,64.6 90 top
S2  5.88,74.76 90 top
U$1  20.73,11.28 0 bottom
U$2  42.98,11.28 0 bottom
U$3  65.23,11.28 0 bottom
U$4  87.48,11.28 0 bottom
U$11  29,96.6 180 top
U$29  4,89.5 0 top
U$30  7.5,90.5 180 top
U$32  11,89.5 180 top

### Tracks (layer width: path | path; a pad name or v marks a point on that pad's centre or on a via)
GND  (via drill 0.3, 0.36, 3 pad 4.5)  (17 unrouted)
  Top 0.2: IC3.8 C3.2 | IC4.8 C7.2 | IC2.8 C6.2 | IC1.8 C8.2
  Top 0.203: C1.2 29.64,87.6 IC5.28 | C2.2 24.8,94.4 IC5.3 24.8,89.89 v24.77,89.85 | v10,95 7.5,92.5 U$30.P$2 7.62,90.38 v7.62,89.85 7.62,81.92 3.98,78.27 S2.2 3.81,77.14 3.81,75.25 3.17,74.61 3.17,68.58 3.98,67.78 S1.2
  Top 0.5: C5.2 86.15,91.4 C4.2
  Top 0.61: 70.6,89.2 v70.48,89.85
  Top 0.813: v14.2,2.6 U$1.GND | v36.4,2.6 U$2.GND | v58.6,2.6 U$3.GND | C5.2 86.2,89.35 86.2,87 87.4,86 96.8,86 96.95,86 97.8,85.2 97.8,7 arc-90 93.4,2.6 v92.4,2.6 v91.6,2.6 | C4.2 80.15,91.55 78.4,89.8 75,89.8 74.2,89 70.8,89 70.6,89.2 70.6,92
  Bottom 0.61: v70.48,89.85 66.99,89.85 v24.77,89.85 v7.62,89.85
  Bottom 0.813: 11.8,2.6 v14.2,2.6 v36.4,2.6 v58.6,2.6 v81,2.6 v92.4,2.6
LEDCLK  (4 unrouted)
LEDCOM11  (1 unrouted)
LEDCOM12  (1 unrouted)
LEDCOM13  (1 unrouted)
LEDCOM14  (1 unrouted)
LEDCOM15  (1 unrouted)
LEDCOM16  (1 unrouted)
LEDCOM17  (1 unrouted)
LEDCOM18  (1 unrouted)
LEDCOM21  (1 unrouted)
LEDCOM22  (1 unrouted)
LEDCOM23  (1 unrouted)
LEDCOM24  (1 unrouted)
LEDCOM25  (1 unrouted)
LEDCOM26  (1 unrouted)
LEDCOM27  (1 unrouted)
LEDCOM28  (1 unrouted)
LEDLE  (4 unrouted)
LEDSIN1  (1 unrouted)
MUX1E  (1 unrouted)
MUX2E  (1 unrouted)
MUX3E  (1 unrouted)
MUX4E  (1 unrouted)
MUXA  (4 unrouted)
MUXB  (4 unrouted)
MUXC  (4 unrouted)
MUXOUT1  (2 unrouted)
MUXOUT2  (2 unrouted)
MUXOUT3  (2 unrouted)
MUXOUT4  (2 unrouted)
N$1  (1 unrouted)
N$2  (1 unrouted)
N$3
  Top 0.2: CN1.D+ 72.4,92.8 72.2,93 69.8,93 69.2,93.6 66.8,93.6 66.6,93.4 66.6,91.4 66.4,91.2 R1.1
N$4
  Top 0.2: CN1.D- 73.2,93.2 73,93.4 70,93.4 69.4,94 66.6,94 66.2,93.6 66.2,92.8 66,92.6 R2.1
N$6  (1 unrouted)
N$7  (1 unrouted)
N$8
  Top 0.203: R3.1 6.03,87.47 U$29.P$2
N$9
  Top 0.203: R42.1 12.2,88.3 U$32.P$2
N$11  (1 unrouted)
N$12  (1 unrouted)
N$13  (1 unrouted)
N$14  (1 unrouted)
N$15  (1 unrouted)
N$16  (1 unrouted)
N$17  (1 unrouted)
N$18  (1 unrouted)
N$19  (1 unrouted)
N$20  (1 unrouted)
N$21  (1 unrouted)
N$22  (1 unrouted)
PB3  (1 unrouted)
RESET  (2 unrouted)
  Top 0.203: R4.1 6.81,61.08 S1.3
SETTING1  (via drill 3 pad 4.5)  (1 unrouted)
  Top 0.203: v5,95 5,94.85 1.27,91.12 1.27,87.23 R43.1
SPI_CLK  (1 unrouted)
SPI_MOSI  (1 unrouted)
STATUS  (1 unrouted)
T8
  Top 0.203: R5.1 6.81,71.24 S2.3
TB1
  Top 0.152: U$1.P$1 12.34,12.04 12.34,21.49 | 12.34,21.49 U$1.P$9 12.34,21.49 | 12.34,31.24 U$1.P$17 12.34,31.24 | 12.34,21.49 12.34,31.24 | 12.34,41 U$1.P$25 12.34,41 | 12.34,31.24 12.34,41 | 12.34,50.75 U$1.P$33 12.34,50.75 | 12.34,41 12.34,50.75 | 12.34,60.5 U$1.P$41 12.34,60.5 | 12.34,50.75 12.34,60.5 | 12.34,70.26 U$1.P$49 12.34,70.26 | 12.34,60.5 12.34,70.26 | U$1.P$57 12.34,80.01 12.34,70.26 | U$1.P$1 12.14,11.84 | IC1.13 12.05,11.75 U$1.P$1
TB2
  Top 0.152: 34.59,21.49 34.59,12.04 U$2.P$1 31.39,11.89 IC2.13 | 34.59,21.49 U$2.P$9 34.59,21.49 | 34.59,31.24 U$2.P$17 34.59,31.24 | 34.59,21.49 34.59,31.24 | 34.59,41 U$2.P$25 34.59,41 | 34.59,31.24 34.59,41 | 34.59,50.75 U$2.P$33 34.59,50.75 | 34.59,41 34.59,50.75 | 34.59,60.5 U$2.P$41 34.59,60.5 | 34.59,50.75 34.59,60.5 | 34.59,70.26 U$2.P$49 34.59,70.26 | 34.59,60.5 34.59,70.26 | U$2.P$57 34.59,80.01 34.59,70.26
TB10
  Top 0.152: IC3.13 53.65,11.89 U$3.P$1 56.84,12.04 56.84,21.79 | 56.84,21.79 U$3.P$9 56.84,21.79 | 56.84,21.79 56.84,31.24 | 56.84,31.24 U$3.P$17 56.84,31.24 | 56.84,41 U$3.P$25 56.84,41 | 56.84,31.24 56.84,41 | 56.84,50.75 U$3.P$33 56.84,50.75 | 56.84,41 56.84,50.75 | 56.84,60.5 U$3.P$41 56.84,60.5 | 56.84,50.75 56.84,60.5 | 56.84,70.26 U$3.P$49 56.84,70.26 | 56.84,60.5 56.84,70.26 | U$3.P$57 56.84,80.01 56.84,70.26
TB11
  Top 0.152: IC3.14 53.65,13.11 U$3.P$2 56.39,13.26 56.39,21.18 56.08,21.49 56.08,22.71 U$3.P$10 56.39,23.01 56.39,30.94 56.08,31.24 56.08,32.46 U$3.P$18 56.39,32.77 56.39,40.69 56.08,41 56.08,42.22 U$3.P$26 56.39,42.52 56.39,50.44 56.08,50.75 56.08,51.97 U$3.P$34 56.39,52.27 56.39,60.2 56.08,60.5 56.08,61.72 U$3.P$42 56.39,62.03 56.39,69.95 56.08,70.26 56.08,71.48 U$3.P$50 56.39,71.78 56.39,79.1 56.08,79.4 56.08,81.23 U$3.P$58
TB12
  Top 0.152: U$1.P$58 11.58,81.23 11.58,80.01 11.89,79.7 11.89,71.78 U$1.P$50 11.58,71.48 11.58,70.26 11.89,69.95 11.89,62.03 U$1.P$42 11.58,61.72 11.58,60.5 11.89,60.2 11.89,52.27 U$1.P$34 11.58,51.97 11.58,50.75 11.89,50.44 11.89,42.52 U$1.P$26 11.58,42.22 11.58,41 11.89,40.69 11.89,32.77 U$1.P$18 11.58,32.46 11.58,31.24 11.89,30.94 11.89,23.01 U$1.P$10 11.58,22.71 11.58,21.49 11.89,21.18 11.89,13.72 11.89,13.26 U$1.P$2 9.2,13.11 IC1.14
TB13
  Top 0.152: U$1.P$3 11.43,14.48 11.43,14.94 11.43,21.18 11.28,21.34 11.28,22.55 11.12,22.71 11.12,23.93 U$1.P$11 11.43,24.23 11.43,30.94 11.12,31.24 11.12,33.68 U$1.P$19 11.43,33.98 11.43,40.69 11.12,41 11.12,43.43 U$1.P$27 11.43,43.74 11.43,50.44 11.12,50.75 11.12,53.19 U$1.P$35 11.43,53.49 11.43,60.2 11.12,60.5 11.12,62.94 U$1.P$43 11.43,63.25 11.43,69.95 11.12,70.26 11.12,72.69 U$1.P$51 11.43,73 11.43,79.7 11.12,80.01 11.12,82.45 U$1.P$59 | U$1.P$3 11.22,14.38 | IC1.15 11.24,14.29 U$1.P$3
TB14
  Top 0.152: U$1.P$60 10.67,83.67 10.67,80.01 10.97,79.7 10.97,74.22 U$1.P$52 10.67,73.91 10.67,70.26 10.97,69.95 10.97,64.47 U$1.P$44 10.67,64.16 10.67,60.5 10.97,60.2 10.97,54.71 U$1.P$36 10.67,54.41 10.67,50.75 10.97,50.44 10.97,44.96 U$1.P$28 10.67,44.65 10.67,41 10.97,40.69 10.97,35.2 U$1.P$20 10.67,34.9 10.67,31.24 10.97,30.94 10.97,25.45 U$1.P$12 10.67,25.15 10.67,23.93 10.82,23.77 10.82,22.55 10.97,22.4 10.97,16 10.97,15.7 U$1.P$4 10.82,14.94 8.08,14.94 7.77,14.63 7.77,10.52 8.99,10.52 IC1.12
TB15  (1 unrouted)
  Top 0.152: U$1.P$5 10.52,16.92 10.52,17.22 10.52,23.62 10.36,23.77 10.36,24.99 10.21,25.15 10.21,26.36 U$1.P$13 10.52,26.67 10.52,30.33 10.21,30.63 10.21,36.12 U$1.P$21 10.52,36.42 10.52,40.08 10.21,40.39 10.21,45.87 U$1.P$29 10.52,46.18 10.52,49.84 10.21,50.14 10.21,55.63 U$1.P$37 10.52,55.93 10.52,59.59 10.21,59.89 10.21,65.38 U$1.P$45 10.52,65.68 10.52,69.34 10.21,69.65 10.21,75.13 U$1.P$53 10.52,75.44 10.52,79.1 10.21,79.4 10.21,84.89 U$1.P$61
TB16  (1 unrouted)
  Top 0.152: U$1.P$6 10.06,18.14 10.06,24.84 9.91,24.99 9.91,26.21 9.75,26.36 9.75,27.58 U$1.P$14 10.06,27.89 10.06,30.33 9.75,30.63 9.75,37.34 U$1.P$22 10.06,37.64 10.06,40.08 9.75,40.39 9.75,47.09 U$1.P$30 10.06,47.4 10.06,49.84 9.75,50.14 9.75,56.84 U$1.P$38 10.06,57.15 10.06,59.59 9.75,59.89 9.75,66.6 U$1.P$46 10.06,66.9 10.06,69.34 9.75,69.65 9.75,76.35 U$1.P$54 10.06,76.66 10.06,79.1 9.75,79.4 9.75,86.11 U$1.P$62
TB17  (1 unrouted)
  Top 0.152: U$1.P$7 9.6,19.36 9.6,26.06 9.3,26.36 9.3,28.8 U$1.P$15 9.6,29.11 9.6,30.33 9.3,30.63 9.3,38.56 U$1.P$23 9.6,38.86 9.6,40.08 9.3,40.39 9.3,48.31 U$1.P$31 9.6,48.62 9.6,49.84 9.3,50.14 9.3,58.06 U$1.P$39 9.6,58.37 9.6,59.59 9.3,59.89 9.3,67.82 U$1.P$47 9.6,68.12 9.6,69.34 9.3,69.65 9.3,77.57 U$1.P$55 9.6,77.88 9.6,79.1 9.3,79.4 9.3,87.33 U$1.P$63
TB18  (1 unrouted)
  Top 0.152: U$1.P$8 8.84,20.57 8.84,22.4 8.84,30.02 | 8.84,30.02 U$1.P$16 8.84,30.02 | 8.84,39.78 U$1.P$24 8.84,39.78 | 8.84,30.02 8.84,39.78 | 8.84,49.53 U$1.P$32 8.84,49.53 | 8.84,39.78 8.84,49.53 | 8.84,59.28 U$1.P$40 8.84,59.28 | 8.84,49.53 8.84,59.28 | 8.84,69.04 U$1.P$48 8.84,69.04 | 8.84,59.28 8.84,69.04 | 8.84,78.79 U$1.P$56 8.84,78.79 | 8.84,69.04 8.84,78.79 | U$1.P$64 8.84,88.54 8.84,78.79
TB19
  Top 0.152: IC3.15 53.65,14.33 U$3.P$3 55.93,14.48 55.93,21.18 55.78,21.34 55.78,22.55 55.63,22.71 55.63,23.93 U$3.P$11 55.93,24.23 55.93,30.94 55.78,31.09 55.78,32.31 55.63,32.46 55.63,33.68 U$3.P$19 55.93,33.98 55.93,40.69 55.78,40.84 55.78,42.06 55.63,42.22 55.63,43.43 U$3.P$27 55.93,43.74 55.93,50.44 55.78,50.6 55.78,51.82 55.63,51.97 55.63,53.19 U$3.P$35 55.93,53.49 55.93,60.2 55.63,60.5 55.63,62.94 U$3.P$43 55.93,63.25 55.93,69.95 55.63,70.26 55.63,72.69 U$3.P$51 55.93,73 55.93,79.1 55.63,79.4 55.63,82.45 U$3.P$59
TB20
  Top 0.152: IC3.12 53.49,10.52 53.03,10.52 52.27,11.28 52.27,14.94 54.71,14.94 U$3.P$4 55.47,15.7 55.47,22.4 55.32,22.55 55.32,23.77 55.17,23.93 55.17,25.15 U$3.P$12 55.47,25.45 55.47,32.16 55.32,32.31 55.32,33.53 55.17,33.68 55.17,34.9 U$3.P$20 55.47,35.2 55.47,41.91 55.17,42.22 55.17,44.65 U$3.P$28 55.47,44.96 55.47,51.66 55.17,51.97 55.17,54.41 U$3.P$36 55.47,54.71 55.47,60.2 55.17,60.5 55.17,64.16 U$3.P$44 55.47,64.47 55.47,69.95 55.17,70.26 55.17,73.91 U$3.P$52 55.47,74.22 55.47,79.1 55.17,79.4 55.17,83.67 U$3.P$60
TB21  (1 unrouted)
  Top 0.152: U$3.P$61 54.71,84.89 54.71,79.4 55.02,79.1 55.02,75.44 U$3.P$53 54.71,75.13 54.71,69.65 55.02,69.34 55.02,65.68 U$3.P$45 54.71,65.38 54.71,59.89 55.02,59.59 55.02,55.93 U$3.P$37 54.71,55.63 54.71,50.14 55.02,49.84 55.02,46.18 U$3.P$29 54.71,45.87 54.71,40.39 55.02,40.08 55.02,36.42 U$3.P$21 54.71,36.12 54.71,33.68 55.02,33.38 55.02,26.67 U$3.P$13 54.71,26.36 54.71,25.15 54.86,24.99 54.86,23.77 55.02,23.62 55.02,16.92 U$3.P$5
TB22  (1 unrouted)
  Top 0.152: U$3.P$6 54.56,18.14 54.56,24.84 54.41,24.99 54.41,26.21 54.25,26.36 54.25,27.58 U$3.P$14 54.56,27.89 54.56,30.33 54.25,30.63 54.25,37.34 U$3.P$22 54.56,37.64 54.56,40.08 54.25,40.39 54.25,47.09 U$3.P$30 54.56,47.4 54.56,49.84 54.25,50.14 54.25,56.84 U$3.P$38 54.56,57.15 54.56,59.59 54.25,59.89 54.25,66.6 U$3.P$46 54.56,66.9 54.56,69.34 54.25,69.65 54.25,76.35 U$3.P$54 54.56,76.66 54.56,79.1 54.25,79.4 54.25,86.11 U$3.P$62
TB23  (1 unrouted)
  Top 0.152: U$3.P$7 54.1,19.36 54.1,26.06 53.8,26.36 53.8,28.8 U$3.P$15 54.1,29.11 54.1,30.33 53.8,30.63 53.8,38.56 U$3.P$23 54.1,38.86 54.1,40.08 53.8,40.39 53.8,48.31 U$3.P$31 54.1,48.62 54.1,49.84 53.8,50.14 53.8,58.06 U$3.P$39 54.1,58.37 54.1,59.59 53.8,59.89 53.8,67.82 U$3.P$47 54.1,68.12 54.1,69.34 53.8,69.65 53.8,77.57 U$3.P$55 54.1,77.88 54.1,79.1 53.8,79.4 53.8,87.33 U$3.P$63
TB24  (1 unrouted)
  Top 0.152: U$3.P$8 53.34,20.57 53.34,23.16 53.34,30.02 | 53.34,30.02 U$3.P$16 53.34,30.02 | 53.34,39.78 U$3.P$24 53.34,39.78 | 53.34,30.02 53.34,39.78 | 53.34,49.53 U$3.P$32 53.34,49.53 | 53.34,39.78 53.34,49.53 | 53.34,59.28 U$3.P$40 53.34,59.28 | 53.34,49.53 53.34,59.28 | 53.34,69.04 U$3.P$48 53.34,69.04 | 53.34,59.28 53.34,69.04 | 53.34,78.79 U$3.P$56 53.34,78.79 | 53.34,69.04 53.34,78.79 | U$3.P$64 53.34,88.54 53.34,78.79
TB25
  Top 0.152: IC4.13 75.89,11.89 U$4.P$1 79.1,12.04 79.1,21.79 | 79.1,21.79 U$4.P$9 79.1,21.79 | 79.1,21.79 79.1,31.24 | 79.1,31.24 U$4.P$17 79.1,31.24 | 79.1,41 U$4.P$25 79.1,41 | 79.1,31.24 79.1,41 | 79.1,50.75 U$4.P$33 79.1,50.75 | 79.1,41 79.1,50.75 | 79.1,60.5 U$4.P$41 79.1,60.5 | 79.1,50.75 79.1,60.5 | 79.1,70.26 U$4.P$49 79.1,70.26 | 79.1,60.5 79.1,70.26 | U$4.P$57 79.1,80.01 79.1,70.26
TB26
  Top 0.152: IC4.14 75.89,13.11 U$4.P$2 78.64,13.26 78.64,21.18 78.33,21.49 78.33,22.71 U$4.P$10 78.64,23.01 78.64,30.94 78.33,31.24 78.33,32.46 U$4.P$18 78.64,32.77 78.64,40.69 78.33,41 78.33,42.22 U$4.P$26 78.64,42.52 78.64,50.44 78.33,50.75 78.33,51.97 U$4.P$34 78.64,52.27 78.64,60.2 78.33,60.5 78.33,61.72 U$4.P$42 78.64,62.03 78.64,69.95 78.33,70.26 78.33,71.48 U$4.P$50 78.64,71.78 78.64,79.1 78.33,79.4 78.33,81.23 U$4.P$58
TB27
  Top 0.152: IC4.15 75.89,14.33 U$4.P$3 78.18,14.48 78.18,21.18 78.03,21.34 78.03,22.55 77.88,22.71 77.88,23.93 U$4.P$11 78.18,24.23 78.18,30.94 78.03,31.09 78.03,32.31 77.88,32.46 77.88,33.68 U$4.P$19 78.18,33.98 78.18,40.69 78.03,40.84 78.03,42.06 77.88,42.22 77.88,43.43 U$4.P$27 78.18,43.74 78.18,50.44 78.03,50.6 78.03,51.82 77.88,51.97 77.88,53.19 U$4.P$35 78.18,53.49 78.18,60.2 77.88,60.5 77.88,62.94 U$4.P$43 78.18,63.25 78.18,69.95 77.88,70.26 77.88,72.69 U$4.P$51 78.18,73 78.18,79.1 77.88,79.4 77.88,82.45 U$4.P$59
TB28
  Top 0.152: IC4.12 75.74,10.52 75.29,10.52 74.52,11.28 74.52,14.94 76.96,14.94 U$4.P$4 77.72,15.7 77.72,22.4 77.57,22.55 77.57,23.77 77.42,23.93 77.42,25.15 U$4.P$12 77.72,25.45 77.72,32.16 77.57,32.31 77.57,33.53 77.42,33.68 77.42,34.9 U$4.P$20 77.72,35.2 77.72,41.91 77.42,42.22 77.42,44.65 U$4.P$28 77.72,44.96 77.72,51.66 77.42,51.97 77.42,54.41 U$4.P$36 77.72,54.71 77.72,60.2 77.42,60.5 77.42,64.16 U$4.P$44 77.72,64.47 77.72,69.95 77.42,70.26 77.42,73.91 U$4.P$52 77.72,74.22 77.72,79.1 77.42,79.4 77.42,83.67 U$4.P$60
TB29  (1 unrouted)
  Top 0.152: IC4.1 69.65,15.7 | U$4.P$61 76.96,84.89 76.96,79.4 77.27,79.1 77.27,75.44 U$4.P$53 76.96,75.13 76.96,69.65 77.27,69.34 77.27,65.68 U$4.P$45 76.96,65.38 76.96,59.89 77.27,59.59 77.27,55.93 U$4.P$37 76.96,55.63 76.96,50.14 77.27,49.84 77.27,46.18 U$4.P$29 76.96,45.87 76.96,40.39 77.27,40.08 77.27,36.42 U$4.P$21 76.96,36.12 76.96,33.68 77.27,33.38 77.27,26.67 U$4.P$13 76.96,26.36 76.96,25.15 77.11,24.99 77.11,23.77 77.27,23.62 77.27,16.92 U$4.P$5
TB30  (1 unrouted)
  Top 0.152: U$4.P$6 76.81,18.14 76.81,24.84 76.66,24.99 76.66,26.21 76.5,26.36 76.5,27.58 U$4.P$14 76.81,27.89 76.81,30.33 76.5,30.63 76.5,37.34 U$4.P$22 76.81,37.64 76.81,40.08 76.5,40.39 76.5,47.09 U$4.P$30 76.81,47.4 76.81,49.84 76.5,50.14 76.5,56.84 U$4.P$38 76.81,57.15 76.81,59.59 76.5,59.89 76.5,66.6 U$4.P$46 76.81,66.9 76.81,69.34 76.5,69.65 76.5,76.35 U$4.P$54 76.81,76.66 76.81,79.1 76.5,79.4 76.5,86.11 U$4.P$62
TB31  (1 unrouted)
  Top 0.152: U$4.P$7 76.35,19.36 76.35,26.06 76.05,26.36 76.05,28.8 U$4.P$15 76.35,29.11 76.35,30.33 76.05,30.63 76.05,38.56 U$4.P$23 76.35,38.86 76.35,40.08 76.05,40.39 76.05,48.31 U$4.P$31 76.35,48.62 76.35,49.84 76.05,50.14 76.05,58.06 U$4.P$39 76.35,58.37 76.35,59.59 76.05,59.89 76.05,67.82 U$4.P$47 76.35,68.12 76.35,69.34 76.05,69.65 76.05,77.57 U$4.P$55 76.35,77.88 76.35,79.1 76.05,79.4 76.05,87.33 U$4.P$63
TB32  (1 unrouted)
  Top 0.152: U$4.P$8 75.59,20.57 75.59,23.32 75.59,30.02 | 75.59,30.02 U$4.P$16 75.59,30.02 | 75.59,39.78 U$4.P$24 75.59,39.78 | 75.59,30.02 75.59,39.78 | 75.59,49.53 U$4.P$32 75.59,49.53 | 75.59,39.78 75.59,49.53 | 75.59,59.28 U$4.P$40 75.59,59.28 | 75.59,49.53 75.59,59.28 | 75.59,69.04 U$4.P$48 75.59,69.04 | 75.59,59.28 75.59,69.04 | 75.59,78.79 U$4.P$56 75.59,78.79 | 75.59,69.04 75.59,78.79 | U$4.P$64 75.59,88.54 75.59,78.79
TB33
  Top 0.152: U$2.P$58 33.83,81.23 33.83,80.01 34.14,79.7 34.14,71.78 U$2.P$50 33.83,71.48 33.83,70.26 34.14,69.95 34.14,62.03 U$2.P$42 33.83,61.72 33.83,60.5 34.14,60.2 34.14,52.27 U$2.P$34 33.83,51.97 33.83,50.75 34.14,50.44 34.14,42.52 U$2.P$26 33.83,42.22 33.83,41 34.14,40.69 34.14,32.77 U$2.P$18 33.83,32.46 33.83,31.24 34.14,30.94 34.14,23.01 U$2.P$10 33.83,22.71 33.83,21.49 34.14,21.18 34.14,13.26 U$2.P$2 31.39,13.11 IC2.14
TB34
  Top 0.152: U$2.P$59 33.38,82.45 33.38,75.74 33.68,75.44 33.68,73 U$2.P$51 33.38,72.69 33.38,65.99 33.68,65.68 33.68,63.25 U$2.P$43 33.38,62.94 33.38,56.24 33.68,55.93 33.68,53.49 U$2.P$35 33.38,53.19 33.38,46.48 33.68,46.18 33.68,43.74 U$2.P$27 33.38,43.43 33.38,36.73 33.68,36.42 33.68,33.98 U$2.P$19 33.38,33.68 33.38,26.98 33.68,26.67 33.68,24.23 U$2.P$11 33.38,23.93 33.38,21.49 33.68,21.18 33.68,14.48 U$2.P$3 31.39,14.33 IC2.15
TB35
  Top 0.152: U$2.P$60 32.92,83.67 32.92,76.96 33.07,76.81 33.07,75.59 33.22,75.44 33.22,74.22 U$2.P$52 32.92,73.91 32.92,67.21 33.07,67.06 33.07,65.84 33.22,65.68 33.22,64.47 U$2.P$44 32.92,64.16 32.92,57.45 33.07,57.3 33.07,56.08 33.22,55.93 33.22,54.71 U$2.P$36 32.92,54.41 32.92,47.7 33.07,47.55 33.07,46.33 33.22,46.18 33.22,44.96 U$2.P$28 32.92,44.65 32.92,37.95 33.07,37.8 33.07,36.58 33.22,36.42 33.22,35.2 U$2.P$20 32.92,34.9 32.92,28.19 33.07,28.04 33.07,26.82 33.22,26.67 33.22,25.45 U$2.P$12 32.92,25.15 32.92,21.49 33.22,21.18 33.22,15.7 U$2.P$4 33.07,14.94 30.18,14.94 30.02,14.78 30.02,10.52 31.24,10.52 IC2.12
TB36  (1 unrouted)
  Top 0.152: U$2.P$5 32.77,16.92 32.77,21.18 32.46,21.49 32.46,26.36 U$2.P$13 32.77,26.67 32.77,27.89 32.61,28.04 32.61,29.26 32.46,29.41 32.46,36.12 U$2.P$21 32.77,36.42 32.77,37.64 32.61,37.8 32.61,39.01 32.46,39.17 32.46,45.87 U$2.P$29 32.77,46.18 32.77,47.4 32.61,47.55 32.61,48.77 32.46,48.92 32.46,55.63 U$2.P$37 32.77,55.93 32.77,57.15 32.61,57.3 32.61,58.52 32.46,58.67 32.46,65.38 U$2.P$45 32.77,65.68 32.77,66.9 32.61,67.06 32.61,68.28 32.46,68.43 32.46,75.13 U$2.P$53 32.77,75.44 32.77,76.66 32.61,76.81 32.61,78.03 32.46,78.18 32.46,84.89 U$2.P$61
TB37  (1 unrouted)
  Top 0.152: U$2.P$6 32.31,18.14 32.31,21.18 32,21.49 32,27.58 U$2.P$14 32.31,27.89 32.31,29.11 32.16,29.26 32.16,30.48 32,30.63 32,37.34 U$2.P$22 32.31,37.64 32.31,38.86 32.16,39.01 32.16,40.23 32,40.39 32,47.09 U$2.P$30 32.31,47.4 32.31,48.62 32.16,48.77 32.16,49.99 32,50.14 32,56.84 U$2.P$38 32.31,57.15 32.31,58.37 32.16,58.52 32.16,59.74 32,59.89 32,66.6 U$2.P$46 32.31,66.9 32.31,68.12 32.16,68.28 32.16,69.49 32,69.65 32,76.35 U$2.P$54 32.31,76.66 32.31,77.88 32.16,78.03 32.16,79.25 32,79.4 32,86.11 U$2.P$62
TB38  (1 unrouted)
  Top 0.152: U$2.P$7 31.85,19.36 31.85,21.18 31.55,21.49 31.55,28.8 U$2.P$15 31.85,29.11 31.85,30.33 31.55,30.63 31.55,38.56 U$2.P$23 31.85,38.86 31.85,40.08 31.55,40.39 31.55,48.31 U$2.P$31 31.85,48.62 31.85,49.84 31.55,50.14 31.55,58.06 U$2.P$39 31.85,58.37 31.85,59.59 31.55,59.89 31.55,67.82 U$2.P$47 31.85,68.12 31.85,69.34 31.55,69.65 31.55,77.57 U$2.P$55 31.85,77.88 31.85,79.1 31.55,79.4 31.55,87.33 U$2.P$63
TB39  (1 unrouted)
  Top 0.152: U$2.P$8 31.09,20.57 31.09,30.02 | 31.09,30.02 U$2.P$16 31.09,30.02 | 31.09,39.78 U$2.P$24 31.09,39.78 | 31.09,30.02 31.09,39.78 | 31.09,49.53 U$2.P$32 31.09,49.53 | 31.09,39.78 31.09,49.53 | 31.09,59.28 U$2.P$40 31.09,59.28 | 31.09,49.53 31.09,59.28 | 31.09,69.04 U$2.P$48 31.09,69.04 | 31.09,59.28 31.09,69.04 | 31.09,78.79 U$2.P$56 31.09,78.79 | 31.09,69.04 31.09,78.79 | U$2.P$64 31.09,88.54 31.09,78.79
UCAP
  Top 0.2: IC5.27 28.04,86.72 28.65,86.72 29.72,85.65 C1.1
USBD+
  Top 0.2: IC5.29 30,88.4 30.2,88.6 33.66,92.08 61.28,92.08 62.15,91.2 R1.2
USBD-
  Top 0.2: IC5.30 29.84,89.22 33.34,92.71 62.55,92.71 arc-60 R2.2
VBUS
  Top 0.5: CN1.VBUS 74,92.6 75.4,94 | C4.1 88.1,93.25 L1.1
  Top 0.813: 75.4,94 79.6,94 80.2,93.4 85.85,93.4 C4.1
VCC  (via drill 0.3, 0.36)  (26 unrouted)
  Top 0.203: C2.1 23.18,93.97 23.18,93.66 24,92.84 IC5.4 23.81,92.11 v23.81,90.81 | IC5.31 IC5.32 v29.2,90.8 v29.21,90.81 | v1.91,90.81 1.91,87.95 3.04,86.81 3.99,86.81 R43.2 4.41,86.39 5.08,85.72 5.08,84.45 | R4.2 4.93,64.77 | 4.93,64.77 R5.2 | 5.08,84.45 5.08,80.33 2.54,77.79 2.54,66.36 4.13,64.77 4.93,64.77 | R3.2 5.09,84.47 5.08,84.45
  Top 0.5: L1.2 88.2,89.75 C5.1
  Top 0.813: v19.4,1 U$1.VCC | v41.6,1 U$2.VCC | v63.8,1 U$3.VCC | v86.2,1 U$4.VCC | L1.2 88.26,91.39 98.21,91.39 99.18,90.42 99.18,7 99.2,7 arc-90 93.2,1 v92.4,1 v91.6,1
  Bottom 0.61: v90.17,91.44 86.36,91.44 85.72,90.81 v29.21,90.81 v23.81,90.81 v1.91,90.81
  Bottom 0.813: 11.8,1 v19.4,1 v41.6,1 v63.8,1 v86.2,1 v92.4,1
VEE  (3 unrouted)
XTAL1
  Top 0.203: IC5.1 26.4,94.3 31.43,94.3 31.43,96.6 U$11.1
XTAL2  (1 unrouted)
  Top 0.203: 26.25,96.5 U$11.3 | IC5.2 25.72,92.41 25.72,95.89

### Text on the board
tPlace: HWB | RESET
bPlace: By SmallRoomLabs.com
_tsilk: LE CLK SDI